# EAGLE schematic RORO_GpsLcdBtn (EAGLE 9.6.2)
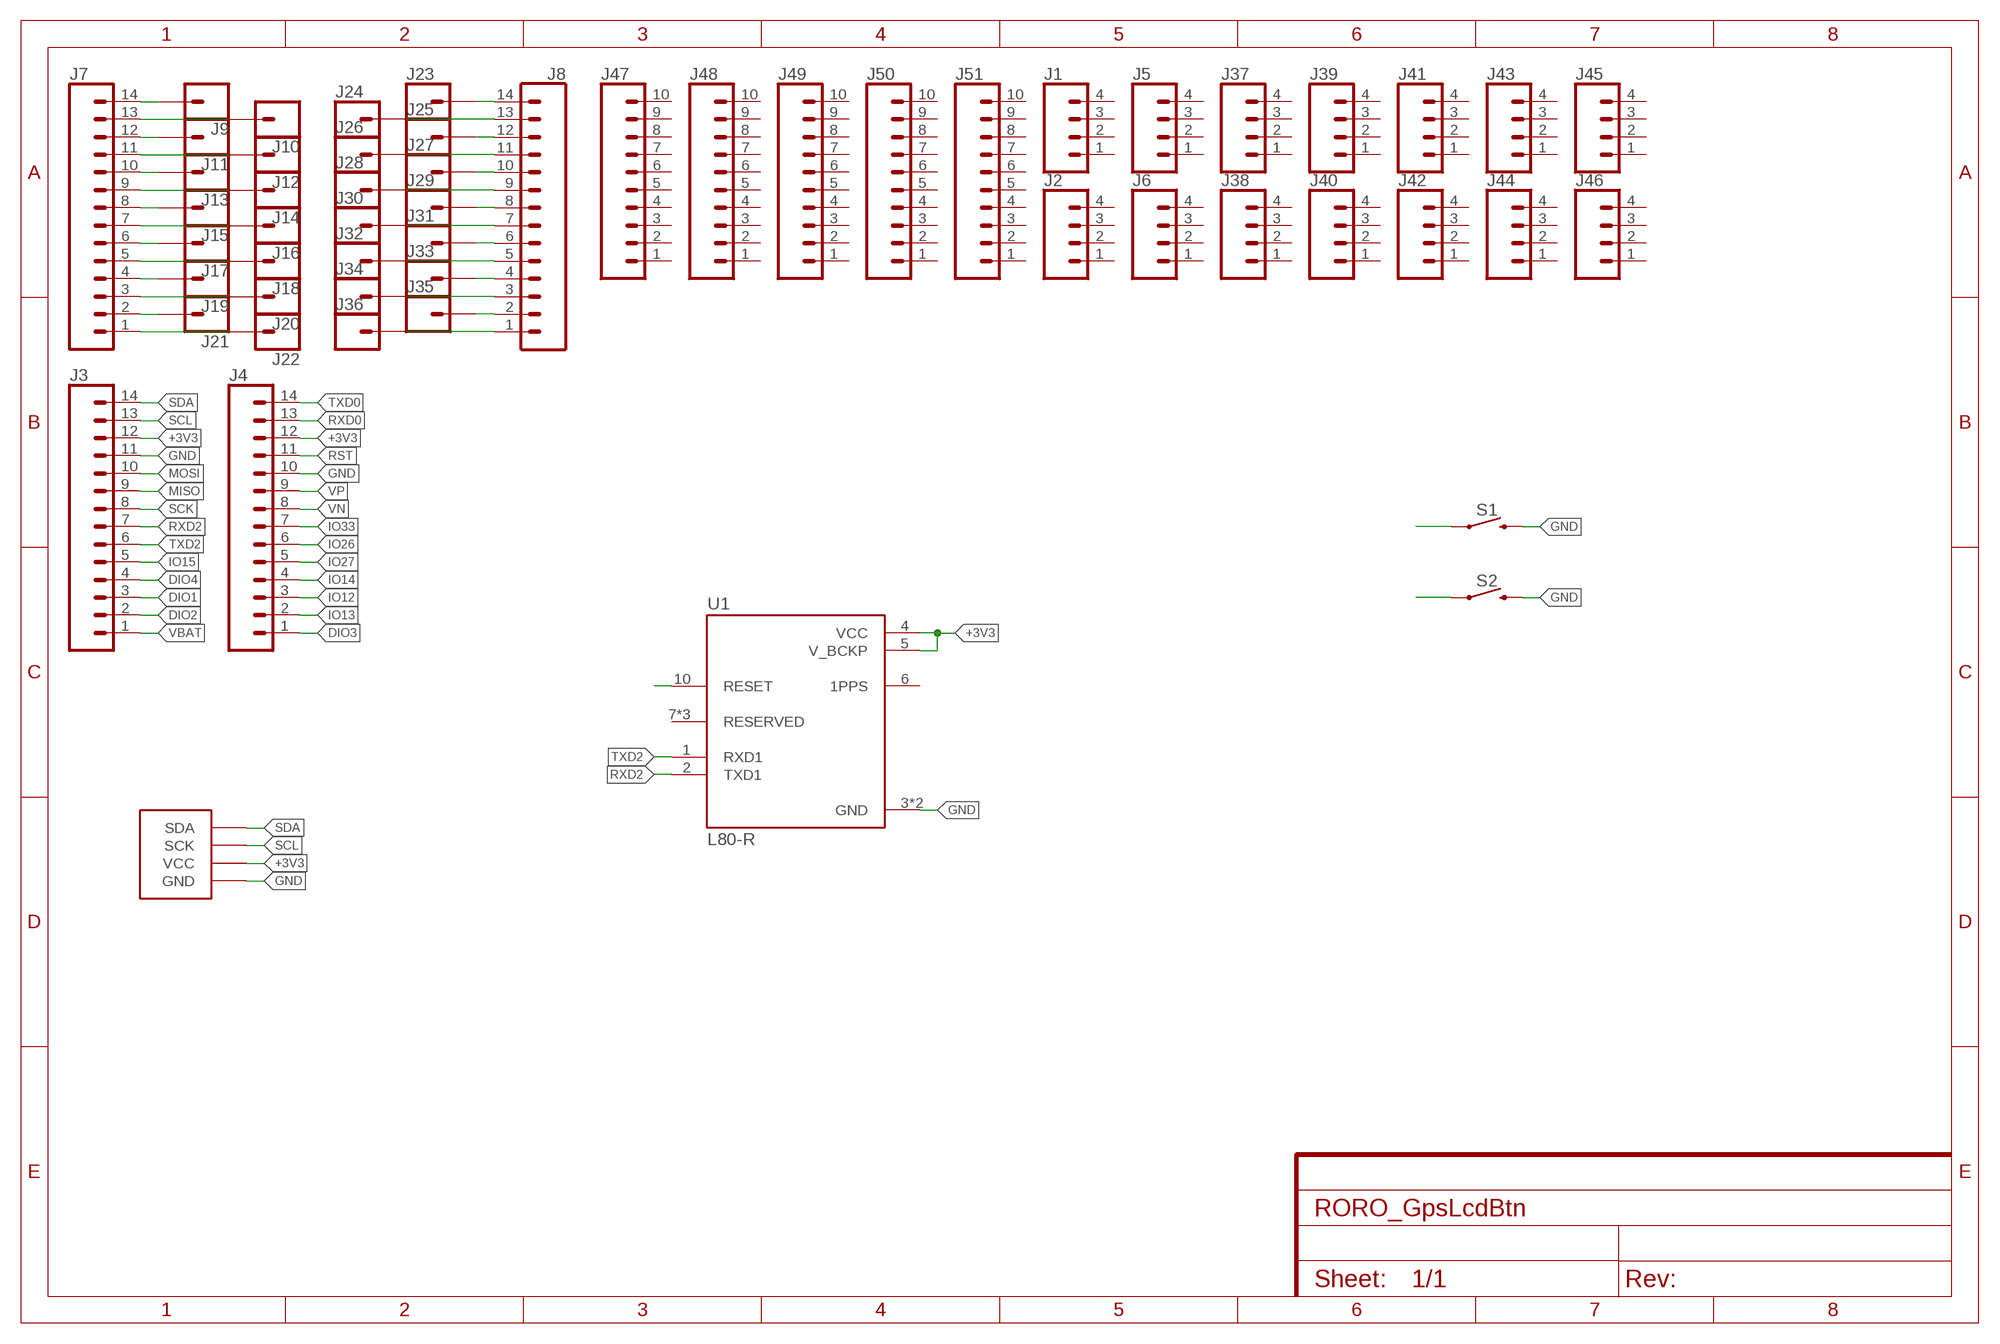
[diagram p0: schematic, sheet 1]

## Parts
J1  CONN_041X04_NO_SILK  [1X04_NO_SILK]
J2  CONN_041X04_NO_SILK  [1X04_NO_SILK]
J3  CONN_14NO_SILK  [1X14_NO_SILK]
J4  CONN_14NO_SILK  [1X14_NO_SILK]
J5  CONN_041X04_NO_SILK  [1X04_NO_SILK]
J6  CONN_041X04_NO_SILK  [1X04_NO_SILK]
J7  CONN_14NO_SILK  [1X14_NO_SILK]
J8  CONN_14NO_SILK  [1X14_NO_SILK]
J9  CONN_01PTH_NO_SILK_KIT  [1X01NS_KIT]
J10  CONN_01PTH_NO_SILK_KIT  [1X01NS_KIT]
J11  CONN_01PTH_NO_SILK_KIT  [1X01NS_KIT]
J12  CONN_01PTH_NO_SILK_KIT  [1X01NS_KIT]
J13  CONN_01PTH_NO_SILK_KIT  [1X01NS_KIT]
J14  CONN_01PTH_NO_SILK_KIT  [1X01NS_KIT]
J15  CONN_01PTH_NO_SILK_KIT  [1X01NS_KIT]
J16  CONN_01PTH_NO_SILK_KIT  [1X01NS_KIT]
J17  CONN_01PTH_NO_SILK_KIT  [1X01NS_KIT]
J18  CONN_01PTH_NO_SILK_KIT  [1X01NS_KIT]
J19  CONN_01PTH_NO_SILK_KIT  [1X01NS_KIT]
J20  CONN_01PTH_NO_SILK_KIT  [1X01NS_KIT]
J21  CONN_01PTH_NO_SILK_KIT  [1X01NS_KIT]
J22  CONN_01PTH_NO_SILK_KIT  [1X01NS_KIT]
J23  CONN_01PTH_NO_SILK_KIT  [1X01NS_KIT]
J24  CONN_01PTH_NO_SILK_KIT  [1X01NS_KIT]
J25  CONN_01PTH_NO_SILK_KIT  [1X01NS_KIT]
J26  CONN_01PTH_NO_SILK_KIT  [1X01NS_KIT]
J27  CONN_01PTH_NO_SILK_KIT  [1X01NS_KIT]
J28  CONN_01PTH_NO_SILK_KIT  [1X01NS_KIT]
J29  CONN_01PTH_NO_SILK_KIT  [1X01NS_KIT]
J30  CONN_01PTH_NO_SILK_KIT  [1X01NS_KIT]
J31  CONN_01PTH_NO_SILK_KIT  [1X01NS_KIT]
J32  CONN_01PTH_NO_SILK_KIT  [1X01NS_KIT]
J33  CONN_01PTH_NO_SILK_KIT  [1X01NS_KIT]
J34  CONN_01PTH_NO_SILK_KIT  [1X01NS_KIT]
J35  CONN_01PTH_NO_SILK_KIT  [1X01NS_KIT]
J36  CONN_01PTH_NO_SILK_KIT  [1X01NS_KIT]
J37  CONN_041X04_NO_SILK  [1X04_NO_SILK]
J38  CONN_041X04_NO_SILK  [1X04_NO_SILK]
J39  CONN_041X04_NO_SILK  [1X04_NO_SILK]
J40  CONN_041X04_NO_SILK  [1X04_NO_SILK]
J41  CONN_041X04_NO_SILK  [1X04_NO_SILK]
J42  CONN_041X04_NO_SILK  [1X04_NO_SILK]
J43  CONN_041X04_NO_SILK  [1X04_NO_SILK]
J44  CONN_041X04_NO_SILK  [1X04_NO_SILK]
J45  CONN_041X04_NO_SILK  [1X04_NO_SILK]
J46  CONN_041X04_NO_SILK  [1X04_NO_SILK]
J47  CONN_10NO_SILK_PTH_FEMALE  [1X10_NO_SILK]
J48  CONN_10NO_SILK_PTH_FEMALE  [1X10_NO_SILK]
J49  CONN_10NO_SILK_PTH_FEMALE  [1X10_NO_SILK]
J50  CONN_10NO_SILK_PTH_FEMALE  [1X10_NO_SILK]
J51  CONN_10NO_SILK_PTH_FEMALE  [1X10_NO_SILK]
S1  MOMENTARY-SWITCH-SPST-SMD-6.0X3.5MM  [TACTILE_SWITCH_SMD_6.0X3.5MM]
S2  MOMENTARY-SWITCH-SPST-SMD-6.0X3.5MM  [TACTILE_SWITCH_SMD_6.0X3.5MM]
U1  L80-R  [XCVR_L80-R]
U$1  128X64_I2COLED  [128X64_I2COLED]

## Nets
+3V3: J3.12 J4.12 U1.4(VCC) U1.5(V_BCKP) U$1.P$3(VCC)
DIO1: J3.3
DIO2: J3.2
DIO3: J4.1
DIO4: J3.4
GND: J3.11 J4.10 S1.2 S2.2 U1.3(GND) U1.12(GND) U$1.P$4(GND)
IO12: J4.3
IO13: J4.2
IO14: J4.4
IO15: J3.5
IO26: J4.6
IO27: J4.5
IO33: J4.7
MISO: J3.9
MOSI: J3.10
N$1: J7.14 J9.1
N$2: J7.13 J10.1
N$3: J7.12 J11.1
N$4: J7.11 J12.1
N$5: J7.10 J13.1
N$6: J7.9 J14.1
N$7: J7.8 J15.1
N$8: J7.7 J16.1
N$9: J7.6 J17.1
N$10: J7.5 J18.1
N$11: J7.4 J19.1
N$12: J7.3 J20.1
N$13: J7.2 J21.1
N$14: J7.1 J22.1
N$15: J8.14 J23.1
N$16: J8.13 J24.1
N$17: J8.12 J25.1
N$18: J8.11 J26.1
N$19: J8.10 J27.1
N$20: J8.9 J28.1
N$21: J8.8 J29.1
N$22: J8.7 J30.1
N$23: J8.6 J31.1
N$24: J8.5 J32.1
N$25: J8.4 J33.1
N$26: J8.3 J34.1
N$27: J8.2 J35.1
N$28: J8.1 J36.1
N$29: S1.1
N$30: S2.1
N$33: U1.10(RESET)
RST: J4.11
RXD0: J4.13
RXD2: J3.7 U1.2(TXD1)
SCK: J3.8
SCL: J3.13 U$1.P$2(SCK)
SDA: J3.14 U$1.P$1(SDA)
TXD0: J4.14
TXD2: J3.6 U1.1(RXD1)
VBAT: J3.1
VN: J4.8
VP: J4.9
Unconnected: J1.1 J1.2 J1.3 J1.4 J2.1 J2.2 J2.3 J2.4 J5.1 J5.2 J5.3 J5.4 J6.1 J6.2 J6.3 J6.4 J37.1 J37.2 J37.3 J37.4 J38.1 J38.2 J38.3 J38.4 J39.1 J39.2 J39.3 J39.4 J40.1 J40.2 J40.3 J40.4 J41.1 J41.2 J41.3 J41.4 J42.1 J42.2 J42.3 J42.4 J43.1 J43.2 J43.3 J43.4 J44.1 J44.2 J44.3 J44.4 J45.1 J45.2 J45.3 J45.4 J46.1 J46.2 J46.3 J46.4 J47.1 J47.2 J47.3 J47.4 J47.5 J47.6 J47.7 J47.8 J47.9 J47.10 J48.1 J48.2 J48.3 J48.4 J48.5 J48.6 J48.7 J48.8 J48.9 J48.10 J49.1 J49.2 J49.3 J49.4 J49.5 J49.6 J49.7 J49.8 J49.9 J49.10 J50.1 J50.2 J50.3 J50.4 J50.5 J50.6 J50.7 J50.8 J50.9 J50.10 J51.1 J51.2 J51.3 J51.4 J51.5 J51.6 J51.7 J51.8 J51.9 J51.10 U1.6(1PPS) U1.7(RESERVED) U1.8(RESERVED) U1.11(RESERVED)

## Library data of the parts
J1 J2 J5 J6 J37-J46 = SparkFun-Connectors:CONN_04: Multi connection point. Often used as Generic Header-pin footprint for 0.1 inch spaced/style header connections On any of the 0.1 inch spaced packages, you can populate with these: Break Away Headers - Straight <https://www.sparkfun.com/products/116> (PRT-00116) Break Away Male Headers - Right Angle <https://www.sparkfun.com/products/553> (PRT-00553) Female Headers <https://www.sparkfun.com/products/115> (PRT-00115) Break Away Headers - Machine Pin <https://www.sparkfun.com/products/117> (PRT-00117) Break Away Female Headers - Swiss Machine Pin <https://www.sparkfun.com/products/743> (PRT-00743) For SCREWTERMINALS and SPRING TERMINALS visit here: Screw Terimnals on SparkFun.com <https://www.sparkfun.com/search/results?term=Screw+Terminals> (5mm/3.5mm/2.54mm spacing) This device is also useful as a general connection point to wire up your design to another part of your project. Our various solder wires solder well into these plated through hole pads. Hook-Up Wire - Assortment (Stranded, 22 AWG) <https://www.sparkfun.com/products/11375> (PRT-11375) Hook-Up Wire - Assortment (Solid Core, 22 AWG) <https://www.sparkfun.com/products/11367> (PRT-11367) View the entire wire category on our website here <https://www.sparkfun.com/categories/141> Special notes: Molex polarized connector foot print use with SKU : PRT-08231 with associated crimp pins and housings. 1MM SMD Version SKU: PRT-10208; PROD_ID: CONN-09696
J3 J4 J7 J8 = SparkFun-Connectors:CONN_14: Multi connection point. Often used as Generic Header-pin footprint for 0.1 inch spaced/style header connections On any of the 0.1 inch spaced packages, you can populate with these: Break Away Headers - Straight <https://www.sparkfun.com/products/116> (PRT-00116) Break Away Male Headers - Right Angle <https://www.sparkfun.com/products/553> (PRT-00553) Female Headers <https://www.sparkfun.com/products/115> (PRT-00115) Break Away Headers - Machine Pin <https://www.sparkfun.com/products/117> (PRT-00117) Break Away Female Headers - Swiss Machine Pin <https://www.sparkfun.com/products/743> (PRT-00743) For SCREWTERMINALS and SPRING TERMINALS visit here: Screw Terimnals on SparkFun.com <https://www.sparkfun.com/search/results?term=Screw+Terminals> (5mm/3.5mm/2.54mm spacing) This device is also useful as a general connection point to wire up your design to another part of your project. Our various solder wires solder well into these plated through hole pads. Hook-Up Wire - Assortment (Stranded, 22 AWG) <https://www.sparkfun.com/products/11375> (PRT-11375) Hook-Up Wire - Assortment (Solid Core, 22 AWG) <https://www.sparkfun.com/products/11367> (PRT-11367) View the entire wire category on our website here <https://www.sparkfun.com/categories/141> Special notes: Molex polarized connector foot print use with SKU : PRT-08231 with associated crimp pins and housings. 1MM SMD Version SKU: PRT-10208 NOTES ON THE VARIANTS LOCK and LOCK_LONGPADS... This footprint was designed to help hold the alignment of a through-hole component (i.e. 6-pin header) while soldering it into place. You may notice that each hole has been shifted either up or down by 0.005 of an inch from it's more standard position (which is a perfectly straight line). This slight alteration caused the pins (the squares in the middle) to touch the edges of the holes. Because they are alternating, it causes a "brace" to hold the component in place. 0.005 has proven to be the perfect amount of "off-center" position when using our standard breakaway headers. Although looks a little odd when you look at the bare footprint, once you have a header in there, the alteration is very hard to notice. Also,if you push a header all the way into place, it is covered up entirely on the bottom side.
J9-J36 = SparkFun-Connectors:CONN_01: Single connection point. Often used as Generic Header-pin footprint for 0.1 inch spaced/style header connections On any of the 0.1 inch spaced packages, you can populate with these: Break Away Headers - Straight <https://www.sparkfun.com/products/116> (PRT-00116) Break Away Male Headers - Right Angle <https://www.sparkfun.com/products/553> (PRT-00553) Female Headers <https://www.sparkfun.com/products/115> (PRT-00115) Break Away Headers - Machine Pin <https://www.sparkfun.com/products/117> (PRT-00117) Break Away Female Headers - Swiss Machine Pin <https://www.sparkfun.com/products/743> (PRT-00743) This device is also useful as a general connection point to wire up your design to another part of your project. Our various solder wires solder well into these plated through hole pads. Hook-Up Wire - Assortment (Stranded, 22 AWG) <https://www.sparkfun.com/products/11375> (PRT-11375) Hook-Up Wire - Assortment (Solid Core, 22 AWG) <https://www.sparkfun.com/products/11367> (PRT-11367) View the entire wire category on our website here <https://www.sparkfun.com/categories/141> Special notes: SMTSO-256-ET is a "flush mount" nut for a 4-40 screw. We mostly use this on specialty testbeds; it is a nice way to connect hardware to your PCB at an adjustable hieght. Also note, the SNAP packages are for using a snappable style connector. We sell a baggie of snaps and they are also used on two LilyPad designs: Snap Assortment - 30 pack (male and female) <https://www.sparkfun.com/products/11347> (DEV-11347) LilyPad Arduino SimpleSnap <https://www.sparkfun.com/products/10941> (DEV-10941) LilyPad SimpleSnap Protoboard <https://www.sparkfun.com/products/10940> (DEV-10940)
J47-J51 = SparkFun-Connectors:CONN_10: Multi connection point. Often used as Generic Header-pin footprint for 0.1 inch spaced/style header connections On any of the 0.1 inch spaced packages, you can populate with these: Break Away Headers - Straight <https://www.sparkfun.com/products/116> (PRT-00116) Break Away Male Headers - Right Angle <https://www.sparkfun.com/products/553> (PRT-00553) Female Headers <https://www.sparkfun.com/products/115> (PRT-00115) Break Away Headers - Machine Pin <https://www.sparkfun.com/products/117> (PRT-00117) Break Away Female Headers - Swiss Machine Pin <https://www.sparkfun.com/products/743> (PRT-00743) Arduino Stackable Header - 10 Pin <https://www.sparkfun.com/products/11376> (PRT-11376) For SCREWTERMINALS and SPRING TERMINALS visit here: Screw Terimnals on SparkFun.com <https://www.sparkfun.com/search/results?term=Screw+Terminals> (5mm/3.5mm/2.54mm spacing) This device is also useful as a general connection point to wire up your design to another part of your project. Our various solder wires solder well into these plated through hole pads. Hook-Up Wire - Assortment (Stranded, 22 AWG) <https://www.sparkfun.com/products/11375> (PRT-11375) Hook-Up Wire - Assortment (Solid Core, 22 AWG) <https://www.sparkfun.com/products/11367> (PRT-11367) View the entire wire category on our website here <https://www.sparkfun.com/categories/141> Special notes: Molex polarized connector foot print use with SKU : PRT-08231 with associated crimp pins and housings. 1MM SMD Version SKU: PRT-10208 NOTES ON THE VARIANTS LOCK and LOCK_LONGPADS... This footprint was designed to help hold the alignment of a through-hole component (i.e. 6-pin header) while soldering it into place. You may notice that each hole has been shifted either up or down by 0.005 of an inch from it's more standard position (which is a perfectly straight line). This slight alteration caused the pins (the squares in the middle) to touch the edges of the holes. Because they are alternating, it causes a "brace" to hold the component in place. 0.005 has proven to be the perfect amount of "off-center" position when using our standard breakaway headers. Although looks a little odd when you look at the bare footprint, once you have a header in there, the alteration is very hard to notice. Also,if you push a header all the way into place, it is covered up entirely on the bottom side.; PROD_ID: CONN-11563
S1 S2 = SparkFun-Switches:MOMENTARY-SWITCH-SPST: Momentary Switch (Pushbutton) - SPST Normally-open (NO) SPST momentary switches (buttons, pushbuttons). Variants PTH-12MM - 12mm square, through-hole Momentary Pushbutton Switch - 12mm Square <https://www.sparkfun.com/products/9190> (COM-09190) PTH-6.0MM, PTH-6.0MM-KIT - 6.0mm square, through-hole Mini Pushbutton Switch <https://www.sparkfun.com/products/97> (COM-00097) KIT package intended for soldering kit's - only one side of pads' copper is exposed. PTH-RIGHT-ANGLE-KIT - Right-angle, through-hole Right Angle Tactile Button <https://www.sparkfun.com/products/10791> - Used on SparkFun BigTime Watch Kit <https://www.sparkfun.com/products/11734> SMD-12MM - 12mm square, surface-mount Tactile Button - SMD (12mm) <https://www.sparkfun.com/products/12993> (COM-12993) Used on SparkFun PicoBoard <https://www.sparkfun.com/products/11888> SMD-4.5MM - 4.5mm Square Trackball Switch Used on SparkFun Blackberry Trackballer Breakout <https://www.sparkfun.com/products/13169> SMD-4.6MMX2.8MM - 4.60mm x 2.80mm, surface mount Used on SparkFun SAMD21 Mini Breakout <https://www.sparkfun.com/products/13664> SMD-5.2MM, SMD-5.2-REDUNDANT - 5.2mm square, surface-mount Mini Pushbutton Switch - SMD <https://www.sparkfun.com/products/8720> (COM-08720) Used on Arduino Pro Mini <https://www.sparkfun.com/products/11114> REDUNDANT package connects both switch circuits together SMD-6.0X3.5MM - 6.0 x 3.5mm, surface mount Momentary Reset Switch SMD <https://www.sparkfun.com/products/8229> (COM-08229) SMD-6.2MM-TALL - 6.2mm square, surface mount Tactile Button - SMD (6mm) <https://www.sparkfun.com/products/12992> Used on SparkFun Digital Sandbox <https://www.sparkfun.com/products/12651> SMD-RIGHT-ANGLE - Right-angle, surface mount Used on SparkFun Block for Intel® Edison - Arduino <https://www.sparkfun.com/products/13036>; PROD_ID: SWCH-00815; SF_SKU: COM-08229
U1 = L80-R:L80-R: Check availability <https://pricing.snapeda.com/parts/L80-R/Quectel/view-part?ref=eda>; AVAILABILITY: In Stock; DESCRIPTION: L80-R is an ultra compact GPS POT (Patch on Top) module with an embedded 15.0mm × 15.0mm × 4.0mm patch antenna; MF: Quectel; MP: L80-R; PACKAGE: None; PRICE: None; PURCHASE-URL: https://pricing.snapeda.com/search/part/L80-R/?ref=eda
U$1 = JLR:128X64_I2COLED

## Net classes
1 vcc: width 0.254 mm